# EAGLE design oximeter (EAGLE 9.5.1)
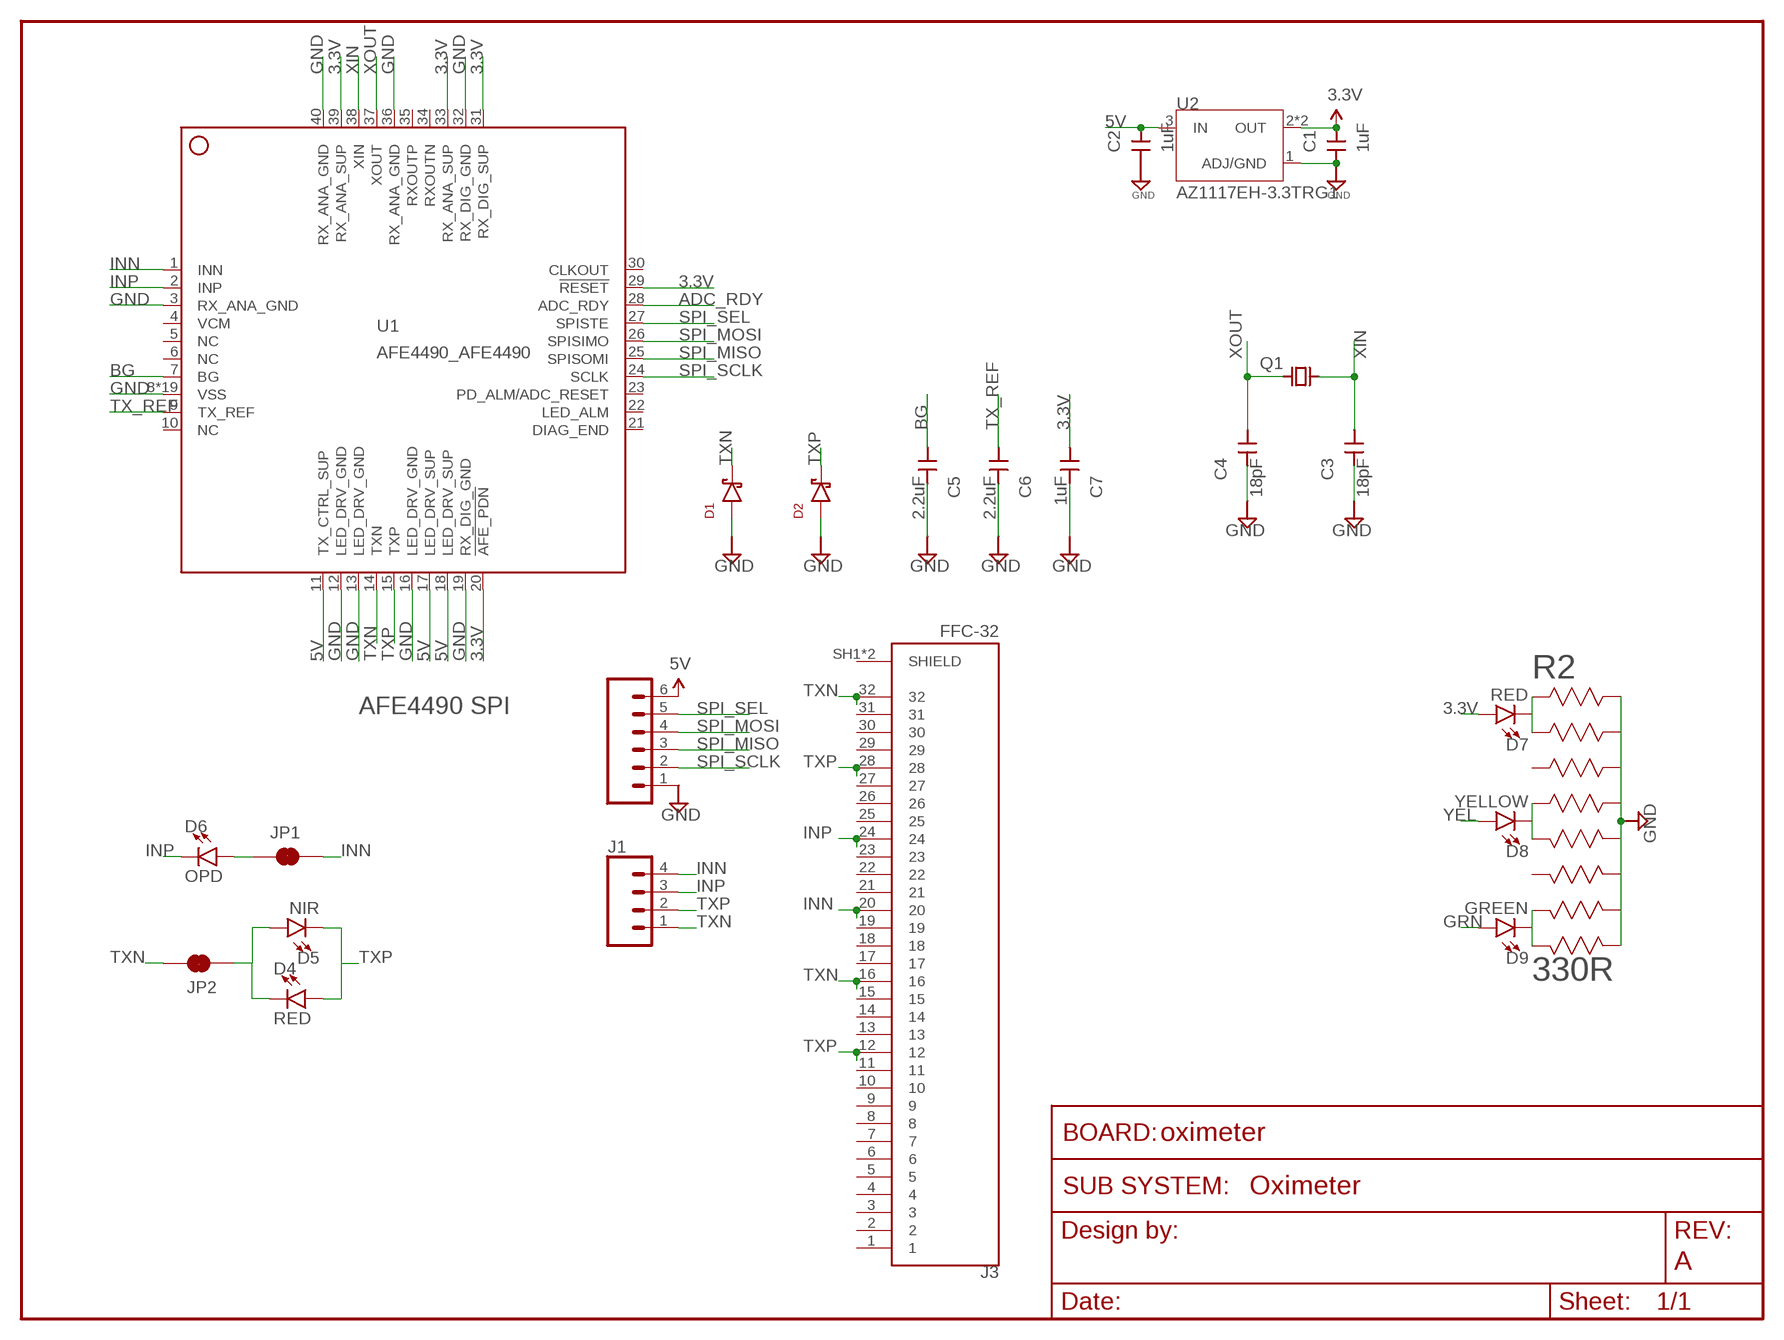
[diagram p0: schematic, sheet 1]
FRAME1 (FRAME_SCHEMATIC): AUTHOR: S.Ono; REV: A; SUBSYSTEM_NAME: Oximeter

## Parts
C1  1uF  CAP0603-CAP  [0603-CAP]
C2  1uF  CAP0603-CAP  [0603-CAP]
C3  18pF  CAP0603-CAP  [0603-CAP]
C4  18pF  CAP0603-CAP  [0603-CAP]
C5  2.2uF  CAP0603-CAP  [0603-CAP]
C6  2.2uF  CAP0603-CAP  [0603-CAP]
C7  1uF  CAP0603-CAP  [0603-CAP]
D1  DIODE_CZRU  [CZRU]
D2  DIODE_CZRU  [CZRU]
D4  RED  LED0603  [LED-0603]
D5  NIR  LED0603  [LED-0603]
D6  OPD  LED1206  [LED-1206]
D7  RED  LED0603  [LED-0603]
D8  YELLOW  LED0603  [LED-0603]
D9  GREEN  LED0603  [LED-0603]
J1  CONN_04  [1X04]
J2  CONN_06SILK_FEMALE_PTH  [1X06]
J3  FFC-32  [MOLEX_503480-3200]
JP1  JUMPER-SMT_2_NC_TRACE_NO-SILK  [SMT-JUMPER_2_NC_TRACE_NO-SILK]
JP2  JUMPER-SMT_2_NC_TRACE_NO-SILK  [SMT-JUMPER_2_NC_TRACE_NO-SILK]
Q1  CRYSTAL_ECS_8MHZ  [XTAL_ECS-80-18-5PX-TR]
R2  330R  RES_BUS  [EXB2HV]
U1  AFE4490_AFE4490  [AFE4490_QFN40-6X6]
U2  AZ1117EH-3.3TRG1  [SOT230P700X180-4N]

## Nets
3.3V: C1.1 C7.1 D7.A U1.20(!AFE_PDN) U1.29(!RESET) U1.31(RX_DIG_SUP) U1.33(RX_ANA_SUP) U1.39(RX_ANA_SUP) U2.2(OUT) U2.4(OUT)
5V: C2.1 J2.6 U1.11(TX_CTRL_SUP) U1.17(LED_DRV_SUP) U1.18(LED_DRV_SUP) U2.3(IN)
ADC_RDY: U1.28(ADC_RDY)
BG: C5.1 U1.7(BG)
GND: C1.2 C2.2 C3.2 C4.2 C5.2 C6.2 C7.2 D1.P D2.P J2.1 R2.9 R2.10 R2.11 R2.12 R2.13 R2.14 R2.15 R2.16 U1.3(RX_ANA_GND) U1.8(VSS) U1.12(LED_DRV_GND) U1.13(LED_DRV_GND) U1.16(LED_DRV_GND) U1.19(RX_DIG_GND) U1.32(RX_DIG_GND) U1.36(RX_ANA_GND) U1.40(RX_ANA_GND) U1.EXP@1(VSS) U1.EXP@2(VSS) U1.EXP@3(VSS) U1.EXP@4(VSS) U1.EXP@5(VSS) U1.EXP@6(VSS) U1.EXP@7(VSS) U1.EXP@8(VSS) U1.EXP@9(VSS) U1.EXP@10(VSS) U1.EXP@11(VSS) U1.EXP@12(VSS) U1.EXP@13(VSS) U1.EXP@14(VSS) U1.EXP@15(VSS) U1.EXP@16(VSS) U1.PWR@1(VSS) U1.PWR@2(VSS) U2.1(ADJ/GND)
GRN: D9.A
INN: J1.4 J3.20 JP1.2 U1.1(INN)
INN_BUF: D6.A JP1.1
INP: D6.C J1.3 J3.24 U1.2(INP)
N$1: J3.31
N$2: J3.15
N$3: J3.27
N$4: J3.11
N$5: D7.C R2.1 R2.2
N$6: D8.C R2.4 R2.5
N$7: D9.C R2.7 R2.8
N$8: J3.19
N$9: J3.23
SPI_MISO: J2.3 U1.25(SPISOMI)
SPI_MOSI: J2.4 U1.26(SPISIMO)
SPI_SCLK: J2.2 U1.24(SCLK)
SPI_SEL: J2.5 U1.27(SPISTE)
TX_REF: C6.1 U1.9(TX_REF)
TXN: D1.N J1.1 J3.16 J3.32 JP2.2 U1.14(TXN)
TXN_BUF: D4.C D5.A JP2.1
TXP: D2.N D4.A D5.C J1.2 J3.12 J3.28 U1.15(TXP)
XIN: C3.1 Q1.1(A) U1.38(XIN)
XOUT: C4.1 Q1.2(B) U1.37(XOUT)
YEL: D8.A
Unconnected: J3.1 J3.2 J3.3 J3.4 J3.5 J3.6 J3.7 J3.8 J3.9 J3.10 J3.13 J3.14 J3.17 J3.18 J3.21 J3.22 J3.25 J3.26 J3.29 J3.30 J3.SH1(SHIELD) J3.SH2(SHIELD) R2.3 R2.6 U1.4(VCM) U1.5(NC) U1.6(NC) U1.10(NC) U1.21(DIAG_END) U1.22(LED_ALM) U1.23(PD_ALM/ADC_RESET) U1.30(CLKOUT) U1.34(RXOUTN) U1.35(RXOUTP)

## Notes on the sheet
- AFE4490 SPI

## Library data of the parts
C1-C7 = scono:CAP: Capacitor Standard 0603 ceramic capacitor, and 0.1" leaded capacitor.; PIE-INT-REF-NUM: CAPACITOR-GENERIC
D1 D2 = scono:DIODE: Diodes - Power Rectification 20V: https://www.digikey.com/product-detail/en/panasonic-electronic-components/DB2S31600L/DB2S31600LCT-ND/2326097 20A: https://www.digikey.com/product-detail/en/on-semiconductor/FSV20100V/FSV20100VCT-ND/5306682
D4 D5 D7-D9 = scono:LED: https://www.digikey.com/products/en/optoelectronics/led-indication-discrete/105?k=&pkeyword=&pv7=2&pv1989=0&pv16=5&FV=ffe00069&quantity=0&ColumnSort=0&page=1&pageSize=25
D6 = scono:LED: https://www.digikey.com/products/en/optoelectronics/led-indication-discrete/105?k=&pkeyword=&pv7=2&pv1989=0&pv16=5&FV=ffe00069&quantity=0&ColumnSort=0&page=1&pageSize=25; PROD_ID: DIO-00862; VALUE: GREEN
J1 = scono:CONN_04: Multi connection point. Often used as Generic Header-pin footprint for 0.1 inch spaced/style header connections On any of the 0.1 inch spaced packages, you can populate with these: Break Away Headers - Straight <https://www.sparkfun.com/products/116> (PRT-00116) Break Away Male Headers - Right Angle <https://www.sparkfun.com/products/553> (PRT-00553) Female Headers <https://www.sparkfun.com/products/115> (PRT-00115) Break Away Headers - Machine Pin <https://www.sparkfun.com/products/117> (PRT-00117) Break Away Female Headers - Swiss Machine Pin <https://www.sparkfun.com/products/743> (PRT-00743) For SCREWTERMINALS and SPRING TERMINALS visit here: Screw Terimnals on SparkFun.com <https://www.sparkfun.com/search/results?term=Screw+Terminals> (5mm/3.5mm/2.54mm spacing) This device is also useful as a general connection point to wire up your design to another part of your project. Our various solder wires solder well into these plated through hole pads. Hook-Up Wire - Assortment (Stranded, 22 AWG) <https://www.sparkfun.com/products/11375> (PRT-11375) Hook-Up Wire - Assortment (Solid Core, 22 AWG) <https://www.sparkfun.com/products/11367> (PRT-11367) View the entire wire category on our website here <https://www.sparkfun.com/categories/141> Special notes: Molex polarized connector foot print use with SKU : PRT-08231 with associated crimp pins and housings. 1MM SMD Version SKU: PRT-10208; PROD_ID: CONN-09696
J2 = scono:CONN_06: Multi connection point. Often used as Generic Header-pin footprint for 0.1 inch spaced/style header connections On any of the 0.1 inch spaced packages, you can populate with these: Break Away Headers - Straight <https://www.sparkfun.com/products/116> (PRT-00116) Break Away Male Headers - Right Angle <https://www.sparkfun.com/products/553> (PRT-00553) Female Headers <https://www.sparkfun.com/products/115> (PRT-00115) Break Away Headers - Machine Pin <https://www.sparkfun.com/products/117> (PRT-00117) Break Away Female Headers - Swiss Machine Pin <https://www.sparkfun.com/products/743> (PRT-00743) Arduino Stackable Header - 6 Pin <https://www.sparkfun.com/products/9280> (PRT-09280) For SCREWTERMINALS and SPRING TERMINALS visit here: Screw Terimnals on SparkFun.com <https://www.sparkfun.com/search/results?term=Screw+Terminals> (5mm/3.5mm/2.54mm spacing) This device is also useful as a general connection point to wire up your design to another part of your project. Our various solder wires solder well into these plated through hole pads. Hook-Up Wire - Assortment (Stranded, 22 AWG) <https://www.sparkfun.com/products/11375> (PRT-11375) Hook-Up Wire - Assortment (Solid Core, 22 AWG) <https://www.sparkfun.com/products/11367> (PRT-11367) View the entire wire category on our website here <https://www.sparkfun.com/categories/141>; PROD_ID: CONN-08437
J3 = scono:FFC-32: 0.50mm Pitch Easy-On™ BackFlip™ Type FPC Connector, 1.00mm Height, Right Angle, SMT, Dual Contact Style, 32 Circuits; DESCRIPTION: 0.50mm Pitch Easy-On™ BackFlip™ Type FPC Connector, 1.00mm Height, Right Angle, Surface Mount, Dual Contact Style, 32...; DIGI-KEY_PART_NUMBER: WM11115CT-ND; DIGI-KEY_PURCHASE_URL: https://www.digikey.com/product-detail/en/molex/5034803200/WM11115CT-ND/5171273?utm_source=snapeda&utm_medium=aggregator&utm_campaign=symbol; MF: Molex; MP: 5034803200; PACKAGE: None
JP1 JP2 = scono:JUMPER-SMT_2_NC_TRACE: Normally closed trace jumper This jumper has a trace between two pads so it's normally closed (NC). Use a razor knife to open the connection. For best results follow the IPC guidelines for cutting traces: Cutout at least 0.063 mm (0.005 in). Remove all loose material to clean up the cut area. Seal the cut with an approved epoxy. Reapply solder to reclose the connection.
Q1 = scono:CRYSTAL
R2 = scono:RES_BUS; MANUFACTURER_PART_NUMBER: EXB2HV331JV; VENDOR: Panasonic
U1 = scono:AFE4490_AFE4490
U2 = scono:AZ1117EH-3.3TRG1: 3.3V 3.3 Reglator Linear; DESCRIPTION: Ldo.Vreg Pos 3, 3v 1a Sot223; DIGI-KEY_PART_NUMBER: AZ1117EH-3.3TRG1DICT-ND; DIGI-KEY_PURCHASE_URL: https://www.digikey.com/product-detail/en/diodes-incorporated/AZ1117EH-3.3TRG1/AZ1117EH-3.3TRG1DICT-ND/5001336?utm_source=snapeda&utm_medium=aggregator&utm_campaign=symbol; MF: Diodes Inc.; MP: AZ1117EH-3.3TRG1; PACKAGE: SOT-223 Diodes Inc.

## Board
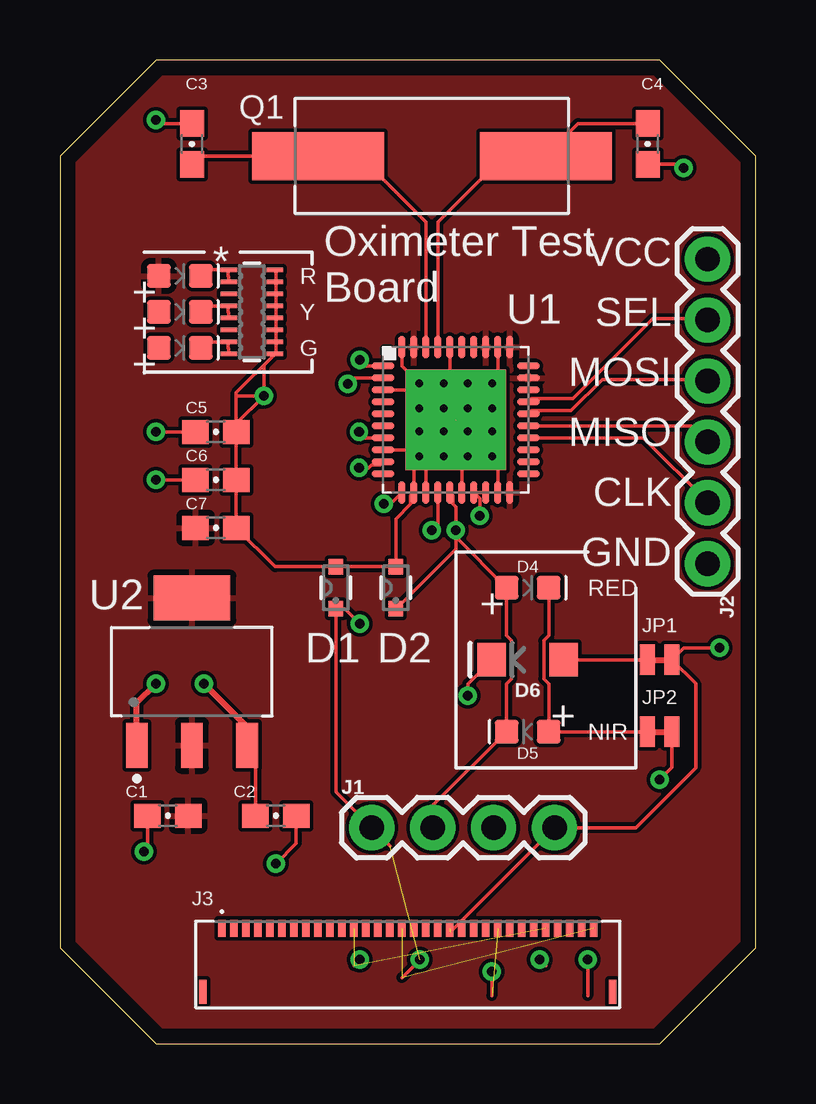
[diagram p1: board, top side]
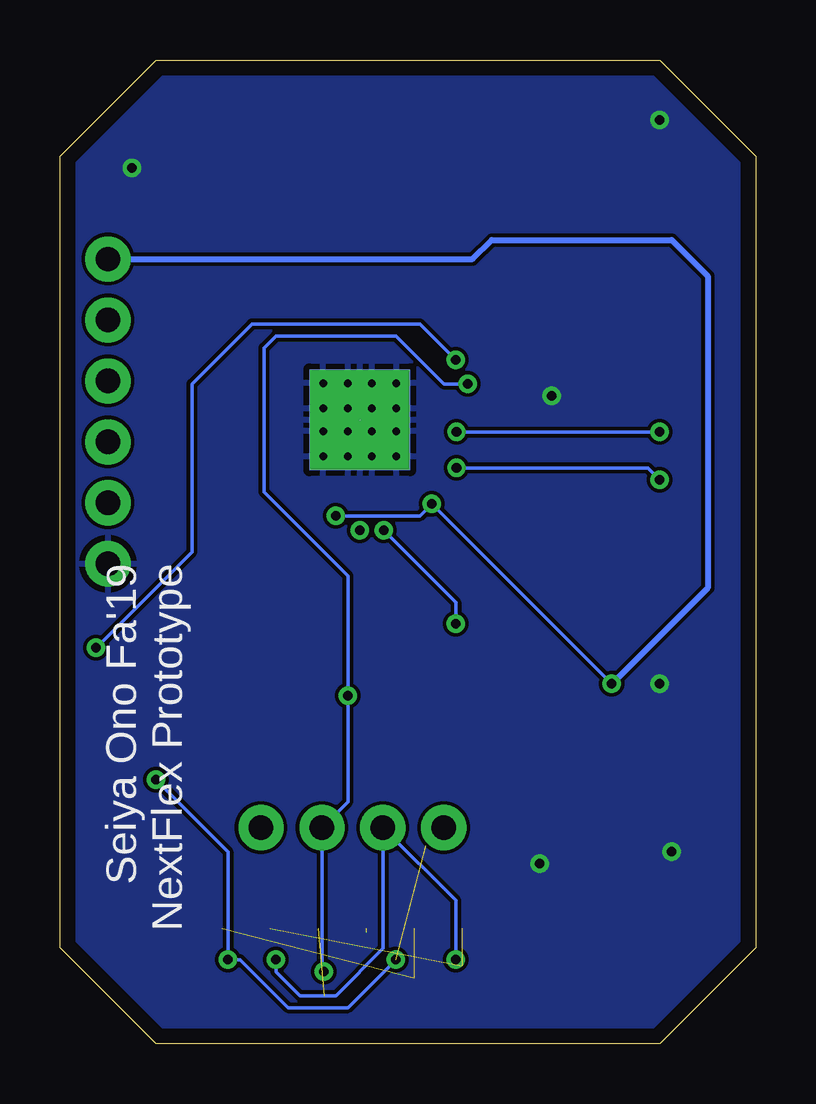
[diagram p2: board, bottom side, seen from below]

Size 29 x 41 mm. Coordinates in mm from the lower left corner, seen from the top.
Outline: 4,0 25,0 29,4 29,37 25,41 4,41 0,37 0,4 4,0
Copper layers (1*16): Top 2mil / dielectric 9mil / Bottom 2mil
Design rules "scono": minimum track width 6mil, minimum drill 15mil, track to track 6mil, track to pad 6mil, pad to pad 6mil, via to via 6mil, smd to smd 6mil, copper to edge 25mil, drill to drill 7mil, minimum pad ring 7mil, minimum via ring 7mil, stop-mask expansion 3mil, vias tented up to drill 0mil, thermal gap 10mil

### Footprints (pad centres in the part's own frame; a part is rotated, then mirrored left to right if it is on the bottom)
0603-CAP = smd 1.1 x 1: 1 -0.85,0; 2 0.85,0
CZRU = smd 0.66 x 0.61: N -0.876,0; P 0.876,0
LED-0603 = smd 1 x 1: A -0.877,0; C 0.877,0
LED-1206 = smd 1.2 x 1.4: A -1.5,0; C 1.5,0
1X04 = drill 1.016 pad 1.88: 1 0,0; 2 2.54,0; 3 5.08,0; 4 7.62,0
1X06 = drill 1.016 pad 1.88: 1 0,0; 2 2.54,0; 3 5.08,0; 4 7.62,0; 5 10.16,0; 6 12.7,0
MOLEX_503480-3200 = smd 0.3 x 0.7: 1 -7.75,1.8; 2 -7.25,1.8; 3 -6.75,1.8; 4 -6.25,1.8; 5 -5.75,1.8; 6 -5.25,1.8; 7 -4.75,1.8; 8 -4.25,1.8; 9 -3.75,1.8; 10 -3.25,1.8; 11 -2.75,1.8; 12 -2.25,1.8; 13 -1.75,1.8; 14 -1.25,1.8; 15 -0.75,1.8; 16 -0.25,1.8; 17 0.25,1.8; 18 0.75,1.8; 19 1.25,1.8; 20 1.75,1.8; 21 2.25,1.8; 22 2.75,1.8; 23 3.25,1.8; 24 3.75,1.8; 25 4.25,1.8; 26 4.75,1.8; 27 5.25,1.8; 28 5.75,1.8; 29 6.25,1.8; 30 6.75,1.8; 31 7.25,1.8; 32 7.75,1.8 | smd 0.3 x 1: SH1 -8.54,-0.85; SH2 8.54,-0.85
SMT-JUMPER_2_NC_TRACE_NO-SILK = smd 0.635 x 1.27: 1 -0.508,0; 2 0.508,0
XTAL_ECS-80-18-5PX-TR = smd 5.5 x 2: 1 -4.75,0; 2 4.75,0
EXB2HV = smd 0.686 x 0.203: 1 -0.965,1.75; 2 -0.965,1.25; 3 -0.965,0.75; 4 -0.965,0.25; 5 -0.965,-0.25; 6 -0.965,-0.75; 7 -0.965,-1.25; 8 -0.965,-1.75; 9 0.965,-1.75; 10 0.965,-1.25; 11 0.965,-0.75; 12 0.965,-0.25; 13 0.965,0.25; 14 0.965,0.75; 15 0.965,1.25; 16 0.965,1.75
AFE4490_QFN40-6X6 = smd 0.95 x 0.28: 1 -3.025,2.25; 2 -3.025,1.75; 3 -3.025,1.25; 4 -3.025,0.75; 5 -3.025,0.25; 6 -3.025,-0.25; 7 -3.025,-0.75; 8 -3.025,-1.25; 9 -3.025,-1.75; 10 -3.025,-2.25; 21 3.025,-2.25; 22 3.025,-1.75; 23 3.025,-1.25; 24 3.025,-0.75; 25 3.025,-0.25; 26 3.025,0.25; 27 3.025,0.75; 28 3.025,1.25; 29 3.025,1.75; 30 3.025,2.25 | smd 0.28 x 0.95: 11 -2.25,-3.025; 12 -1.75,-3.025; 13 -1.25,-3.025; 14 -0.75,-3.025; 15 -0.25,-3.025; 16 0.25,-3.025; 17 0.75,-3.025; 18 1.25,-3.025; 19 1.75,-3.025; 20 2.25,-3.025; 31 2.25,3.025; 32 1.75,3.025; 33 1.25,3.025; 34 0.75,3.025; 35 0.25,3.025; 36 -0.25,3.025; 37 -0.75,3.025; 38 -1.25,3.025; 39 -1.75,3.025; 40 -2.25,3.025 | drill 0.3 pad 1.1 square: EXP@1 -1.525,1.525; EXP@2 -0.5,1.525; EXP@3 0.5,1.525; EXP@4 1.525,1.525; EXP@5 -1.525,0.475; EXP@6 -0.5,0.475; EXP@7 0.5,0.475; EXP@8 1.525,0.475; EXP@9 -1.525,-0.475; EXP@10 -0.5,-0.475; EXP@11 0.5,-0.475; EXP@12 1.525,-0.475; EXP@13 -1.525,-1.525; EXP@14 -0.5,-1.525; EXP@15 0.5,-1.525; EXP@16 1.525,-1.525 | smd 4.191 x 4.191 bottom: PWR@1 0,0 | smd 4.191 x 4.191: PWR@2 0,0
SOT230P700X180-4N = smd 1.86 x 0.9: 1 -3.075,2.3; 2 -3.075,0; 3 -3.075,-2.3 | smd 1.86 x 3.19: 4 3.075,0

### Placement (x,y rotation side)
C1  4.5,9.5 180 top
C2  9,9.5 0 top
C3  5.5,37.5 90 top
C4  24.5,37.5 270 top
C5  6.5,25.5 0 top
C6  6.5,23.5 0 top
C7  6.5,21.5 0 top
D1  11.5,19 90 top
D2  14,19 90 top
D4  19.5,19 0 top
D5  19.5,13 180 top
D6  19.5,16 180 top
D7  5,32 0 top
D8  5,30.5 0 top
D9  5,29 0 top
J1  13,9 0 top
J2  27,20 90 top
J3  14.5,3 0 top
JP1  25,16 0 top
JP2  25,13 0 top
Q1  15.5,37 0 top
R2  8,30.5 0 top
U1  16.5,26 0 top
U2  5.5,15.5 90 top

### Tracks (layer width: path | path; a pad name or v marks a point on that pad's centre or on a via)
3.3V
  pour Top: 0,37 4,41 25,41 29,37 29,4 25,0 4,0 0,4
5V  (via drill 0.4)
  Top 0.152: U1.11 13.78,22.5 v13.5,22.5 | U1.18 U1.17 17.5,22.73 v17.5,22 | U2.3 8.15,12.07 C2.1
  Top 0.256: v6,15 7.8,13.2 U2.3
  Bottom 0.152: v17.5,22 14,22 v13.5,22.5 v6,15
  Bottom 0.256: v6,15 2,19 2,32 3.5,33.5 11,33.5 11.8,32.7 J2.6
BG  (via drill 0.4)
  Top 0.152: U1.7 12.72,25.25 v12.47,25.5 | v4,25.5 C5.1
  Bottom 0.152: v12.47,25.5 v4,25.5
GND  (via drill 0.4)  (1 unrouted)
  Top 0.152: R2.16 9,32.25 9,31.79 R2.15 9,31.71 9,31.29 R2.14 9,31.21 9,30.79 R2.13 9,30.71 9,30.29 R2.12 9,30.21 9,29.79 R2.11 9,29.71 9,29.29 R2.10 9,29.21 9,28.79 R2.9 8.86,28.64 | C3.2 4.15,38.35 v4,38.5 | C4.2 25.85,36.65 v26,36.5 | U1.32 18.25,27.75 U1.EXP@4 U1.PWR@2 | U1.36 16.25,27.77 U1.EXP@2 16.5,27.02 | U1.40 14.25,28.25 U1.EXP@1 | U1.3 14.7,27.25 U1.EXP@1 | U1.8 14.7,24.75 U1.EXP@13 | U1.EXP@13 14.75,24.25 U1.12 14.62,22.84 14.62,22.49 14,21.87 D2.P D1.P 8.97,19.88 C7.2 C6.2 C5.2 | U1.13 15.25,24.2 U1.EXP@13 | U1.16 16.75,24.23 U1.EXP@15 16.5,24.98 U1.PWR@2 | U1.19 18.25,24.25 U1.EXP@16 U1.PWR@2 | C5.2 7.35,27 | 7.35,27 7.35,27.14 8.86,28.64 | 7.35,27 v8.5,27 | C1.2 3.65,8.15 v3.5,8 | C2.2 9.85,8.35 v9,7.5 | U1.PWR@2 16.5,27.02 | 16.5,27.02 16.99,27.51 | 16.99,27.51 U1.EXP@3 | U1.PWR@2 16.5,27.02 | U1.PWR@2 U1.EXP@1 | U1.EXP@5 U1.EXP@6 16.02,26.48 U1.PWR@2 | U1.PWR@2 16.98,26.48 | 16.98,26.48 U1.EXP@7 | U1.PWR@2 16.98,26.48 | 16.98,26.48 U1.EXP@8 | U1.PWR@2 17.55,26 U1.EXP@12 | U1.PWR@2 16.52,26 U1.EXP@11 | U1.PWR@2 16.02,25.52 | 16.02,25.52 U1.EXP@10 | U1.PWR@2 16.02,25.52 | 16.02,25.52 U1.EXP@9 | U1.PWR@2 U1.EXP@13 | U1.PWR@2 16,25.5 U1.EXP@14 | U1.PWR@2 16.5,27.02 | 16.5,27.02 16.99,27.51 | v8.5,27 8.5,28.29 8.86,28.64 | v8.5,27 7.35,25.85 C5.2
  Top 0.25: U2.1 3.2,14.2 v4,15
  pour Bottom: 0,37 4,41 25,41 29,37 29,4 25,0 4,0 0,4
INN  (via drill 0.4)  (1 unrouted)
  Top 0.152: U1.1 12.75,28.25 v12.5,28.5 | 16.25,4.63 J1.4 24,9 26.5,11.5 26.5,15.01 JP1.2 26.01,16.5 v27.5,16.5
  Bottom 0.152: v27.5,16.5 23.5,20.5 23.5,27.5 21,30 14,30 v12.5,28.5
INN_BUF
  Top 0.152: JP1.1 D6.A
INP  (via drill 0.4)  (1 unrouted)
  Top 0.152: U1.2 12.25,27.75 v12,27.5 | v18,3 18,2 | v17,14.5 17,15 D6.C
  Bottom 0.152: v18,3 18.08,3.08 J1.3 17,10.08 v17,14.5 17,19.5 19,21.5 20.5,23 20.5,29 20,29.5 15,29.5 13,27.5 v12,27.5
N$5
  Top 0.152: D7.C 5.88,32.25 R2.1 7,32.22 7,32 7.04,31.96 R2.2
N$6
  Top 0.152: D8.C 5.88,30.75 R2.4 7,30.71 7,30.5 7.04,30.46 R2.5
N$7
  Top 0.152: D9.C 5.88,29.25 R2.7 7,29.21 7,29 7.04,28.96 R2.8
SPI_MISO
  Top 0.152: J2.3 26.33,25.75 U1.25
SPI_MOSI
  Top 0.152: U1.26 19.66,26.38 20,26.38 | 20,26.38 20.01,26.38 | 20,26.38 20.01,26.38 | 20.01,26.38 21.31,26.38 22.61,27.68 26.94,27.68 J2.4
SPI_SCLK
  Top 0.152: U1.24 24.33,25.25 27,22.58 J2.2
SPI_SEL
  Top 0.152: U1.27 19.66,26.88 20.01,26.88 21.38,26.88 24.72,30.22 26.94,30.22 J2.5
TX_REF  (via drill 0.4)
  Top 0.152: U1.9 13.34,24.12 12.99,24.12 12.87,24 v12.47,24 | C6.1 v4,23.5
  Bottom 0.152: v4,23.5 4.5,24 v12.47,24
TXN  (via drill 0.4)  (3 unrouted)
  Top 0.152: U1.14 15.75,21.64 v15.5,21.39 | JP2.2 25.51,11.51 v25,11 | v22,3.5 22,2 | 13.75,8.25 J1.1 11.5,10.5 D1.N 11.88,18.12 v12.5,17.5 | v15,3.5 14.25,2.75
  Bottom 0.152: v25,11 22,8 v22,3.5 21.5,3.5 19.5,1.5 17,1.5 v15,3.5 | v15.5,21.39 12.5,18.39 v12.5,17.5
TXN_BUF
  Top 0.152: D4.C 20.38,17 20.17,16.8 20.17,15.21 20.38,15 D5.A JP2.1
TXP  (via drill 0.4)  (2 unrouted)
  Top 0.152: U1.15 16.38,22.84 16.38,22.49 16.5,22.37 v16.5,21.39 | v16.5,21.39 16.5,21.12 D4.A 18.62,17 18.83,16.8 18.83,15.21 18.62,15 D5.C 15.54,9.92 J1.2 | 20.25,3.25 v20,3.5 | 12.25,3.25 v12.5,3.5 | D2.N 16.5,20.62 v16.5,21.39
  Bottom 0.152: v12.5,3.5 12.5,5.96 J1.2 15.54,3.96 17.5,2 19,2 20,3 v20,3.5
XIN
  Top 0.152: C3.1 5.85,37 Q1.1 12.5,37 15.25,34.25 U1.38
XOUT
  Top 0.152: C4.1 21.6,38.35 Q1.2 18.5,37 15.75,34.25 U1.37

### Text on the board
tPlace: VCC | R | Oximeter Test / Board | Y | SEL | G | MOSI | MISO | CLK | GND | RED | NIR
bPlace: Seiya Ono Fa'19 / NextFlex Prototype